# EasyEDA schematic SCH_Dashboy camera_NiMH_2023-03-14.json
TITLE: Dashboy Camera PCB; REV: 1.0; Date: 2023-03-13; Sheet: 1/1; Company: by Raphaël BOICHOT
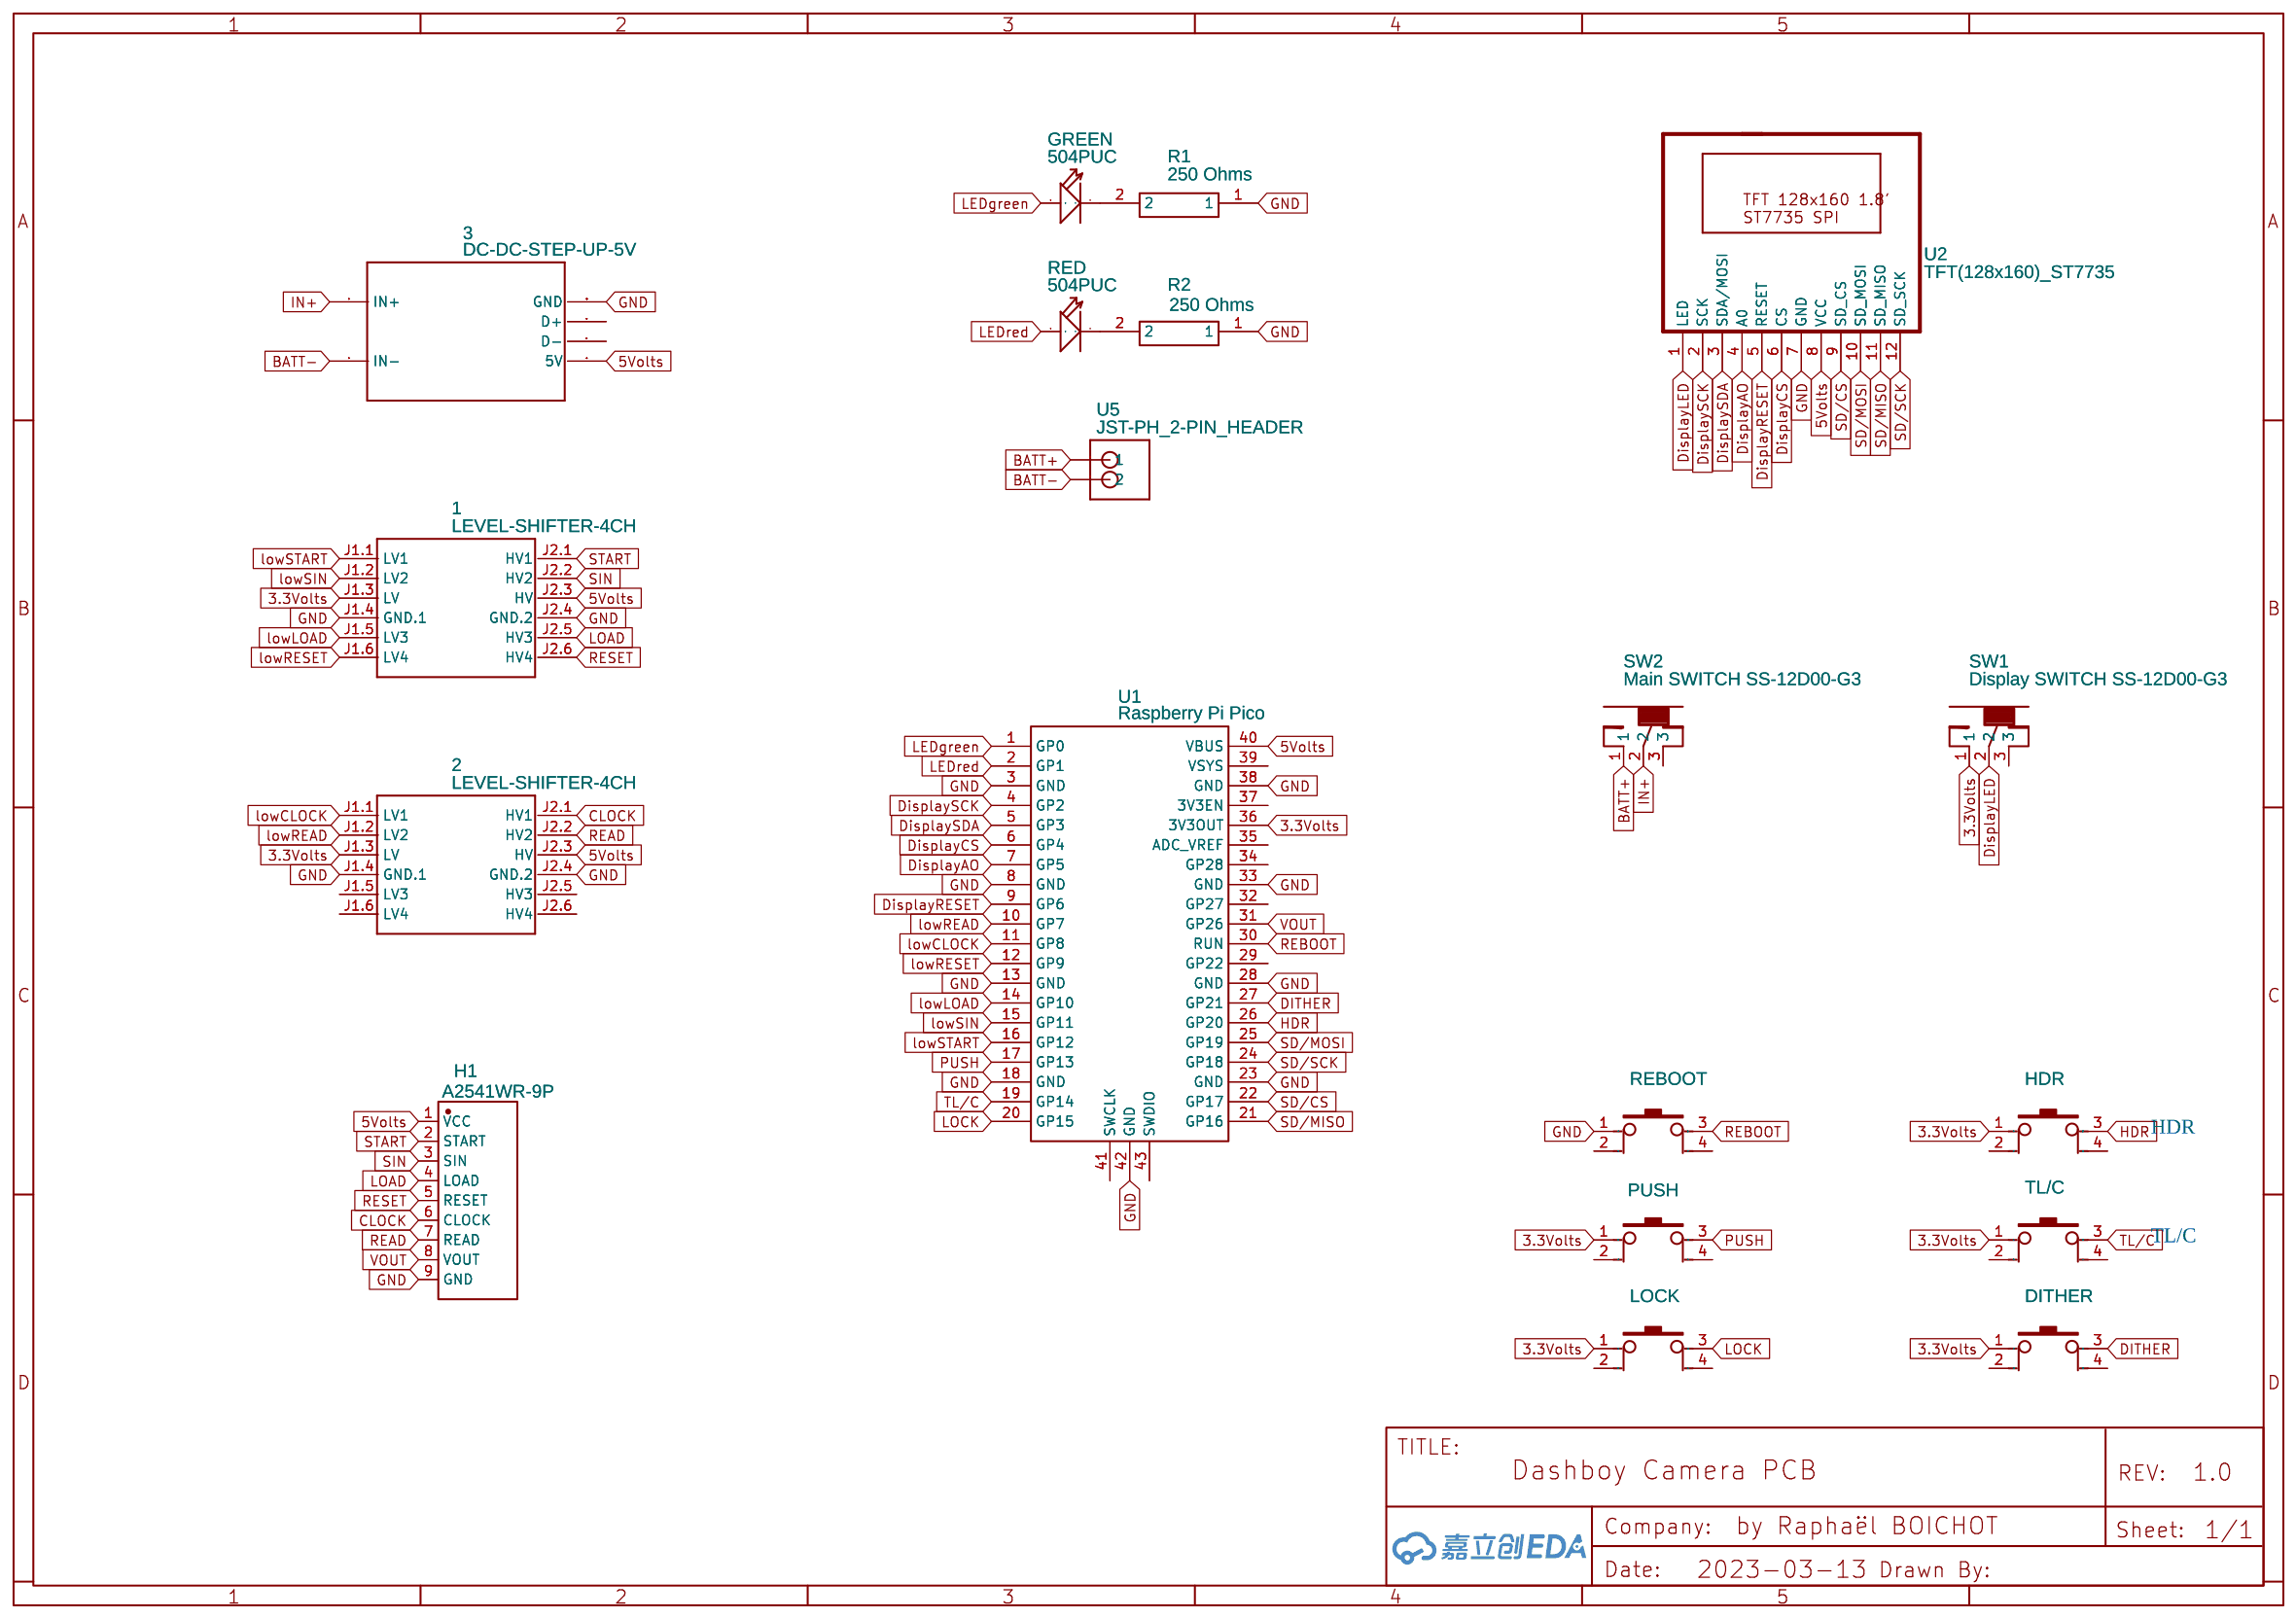
[diagram p0: schematic sheet]

## Parts
1  LEVEL-SHIFTER-4CH  [LEVEL-SHIFTER-4CH]
2  LEVEL-SHIFTER-4CH  [LEVEL-SHIFTER-4CH]
3  DC-DC-STEP-UP-5V  [DC-DC-STEP-UP-5V]
DITHER  BoutonPoussoir  [BOUTONPUSH]
GREEN  504PUC  [LED2-2.54-D5.0MM]
H1  A2541WR-9P  [HDR-TH_9P-P2.54-H-W8.6_A2541WR-9P]
HDR  BoutonPoussoir  [BOUTONPUSH]
LOCK  BoutonPoussoir  [BOUTONPUSH]
PUSH  BoutonPoussoir  [BOUTONPUSH]
R1  250 Ohms  [RESISTOR]
R2  250 Ohms  [RESISTOR]
REBOOT  BoutonPoussoir  [BOUTONPUSH]
RED  504PUC  [LED2-2.54-D5.0MM]
SW1  Display SWITCH SS-12D00-G3  [TOGGLE SWITCH SS-12D00-G3]
SW2  Main SWITCH SS-12D00-G3  [TOGGLE SWITCH SS-12D00-G3]
TL/C  BoutonPoussoir  [BOUTONPUSH]
U1  Raspberry Pi Pico  [RASPBERRY-PI-PICO]
U2  TFT(128x160)_ST7735  [MI_TFT1,8_SPI_128X160ST7735S]
U5  JST-PH_2-PIN_HEADER  [JST_B2B-PH_HEADER]

## Library data of the parts
1 2 = LEVEL-SHIFTER-4CH: Contributor: Thafhan Fathur Rahman
3 = DC-DC-STEP-UP-5V: Contributor: mariusz.kacprzak
DITHER HDR LOCK PUSH REBOOT TL/C = BoutonPoussoir: Supplier Part: C59982; Supplier: LCSC; Manufacturer: ReliaPro; Manufacturer Part: button6*6*8; image: http://image.lceda.cn/szlcsc/C59982.jpg; Contributor: Marwane 0306
GREEN RED = 504PUC: DIP LED Transparent-Purple-5mm;
H1 = A2541WR-9P: Supplier: LCSC; Supplier Part: C225495; Manufacturer: Changjiang Connectors; Contributor: LCSC; JLCPCB Part Class: Extended Part
R1 R2 = RESITOR: Contributor: rander
SW1 SW2 = TOGGLE SWITCH SS-12D00-G3: Supplier: aliexpress; Manufacturer: Dailywell; Contributor: Gibo222; link: https://de.aliexpress.com/item/32756772435.html?spm=a2g0o.productlist.0.0.4e077708sX2Al2&algo_pvid=716abed2-2433-4a4c-8d27-293a4e4961c2&algo_expid=716abed2-2433-4a4c-8d27-293a4e4961c2-8&btsid=2100bddd16119266912771087e59d6&ws_ab_test=searchweb0_0,searchweb201602_,searchweb201603_
U1 = Raspberry Pi Pico: Contributor: ostrander.jm
U2 = TFT(128x160)_ST7735: Contributor: Rafael Angel González; Package Display: No
U5 = JST-PH_2-PIN_HEADER

## Nets
3.3Volts: 1.J1.3(LV) 2.J1.3(LV) DITHER.1 HDR.1 LOCK.1 PUSH.1 SW1.1 TL/C.1 U1.36(3V3OUT)
5Volts: 1.J2.3(HV) 2.J2.3(HV) 3.5V H1.1(VCC) U1.40(VBUS) U2.8(VCC)
GND: 1.J1.4(GND.1) 1.J2.4(GND.2) 2.J1.4(GND.1) 2.J2.4(GND.2) 3.GND H1.9(GND) R1.1 R2.1 REBOOT.1 U1.3(GND) U1.8(GND) U1.13(GND) U1.18(GND) U1.23(GND) U1.28(GND) U1.33(GND) U1.38(GND) U1.42(GND) U2.7(GND)
BATT+: SW2.1 U5.P1(1)
BATT-: 3.IN- U5.P2(2)
CLOCK: 2.J2.1(HV1) H1.6(CLOCK)
DisplayAO: U1.7(GP5) U2.4(A0)
DisplayCS: U1.6(GP4) U2.6(CS)
DisplayLED: SW1.2 U2.1(LED)
DisplayRESET: U1.9(GP6) U2.5(RESET)
DisplaySCK: U1.4(GP2) U2.2(SCK)
DisplaySDA: U1.5(GP3) U2.3(SDA/MOSI)
DITHER: DITHER.3 U1.27(GP21)
HDR: HDR.3 U1.26(GP20)
IN+: 3.IN+ SW2.2
LEDgreen: GREEN.+ U1.1(GP0)
LEDred: RED.+ U1.2(GP1)
LOAD: 1.J2.5(HV3) H1.4(LOAD)
LOCK: LOCK.3 U1.20(GP15)
lowCLOCK: 2.J1.1(LV1) U1.11(GP8)
lowLOAD: 1.J1.5(LV3) U1.14(GP10)
lowREAD: 2.J1.2(LV2) U1.10(GP7)
lowRESET: 1.J1.6(LV4) U1.12(GP9)
lowSIN: 1.J1.2(LV2) U1.15(GP11)
lowSTART: 1.J1.1(LV1) U1.16(GP12)
PUSH: PUSH.3 U1.17(GP13)
READ: 2.J2.2(HV2) H1.7(READ)
REBOOT: REBOOT.3 U1.30(RUN)
RESET: 1.J2.6(HV4) H1.5(RESET)
SD/CS: U1.22(GP17) U2.9(SD_CS)
SD/MISO: U1.21(GP16) U2.11(SD_MISO)
SD/MOSI: U1.25(GP19) U2.10(SD_MOSI)
SD/SCK: U1.24(GP18) U2.12(SD_SCK)
SIN: 1.J2.2(HV2) H1.3(SIN)
START: 1.J2.1(HV1) H1.2(START)
TL/C: TL/C.3 U1.19(GP14)
VOUT: H1.8(VOUT) U1.31(GP26)
Net-(GREEN--): GREEN.- R1.2
Net-(R2-2): R2.2 RED.-

Not connected (* = marked no-connect by the designer): 2 J1.5(LV3) J1.6(LV4) J2.5(HV3) J2.6(HV4); 3 D+ D-; DITHER 2 4; HDR 2 4; LOCK 2 4; PUSH 2 4; REBOOT 2 4; SW1 3; SW2 3; TL/C 2 4; U1 29(GP22) 32(GP27) 34(GP28) 35(ADC_VREF) 37(3V3EN) 39(VSYS) 41(SWCLK) 43(SWDIO)

## Notes on the sheet
- HDR
- TL/C
